# EAGLE design arm_femur_wLED_smd (EAGLE 7.3.0)
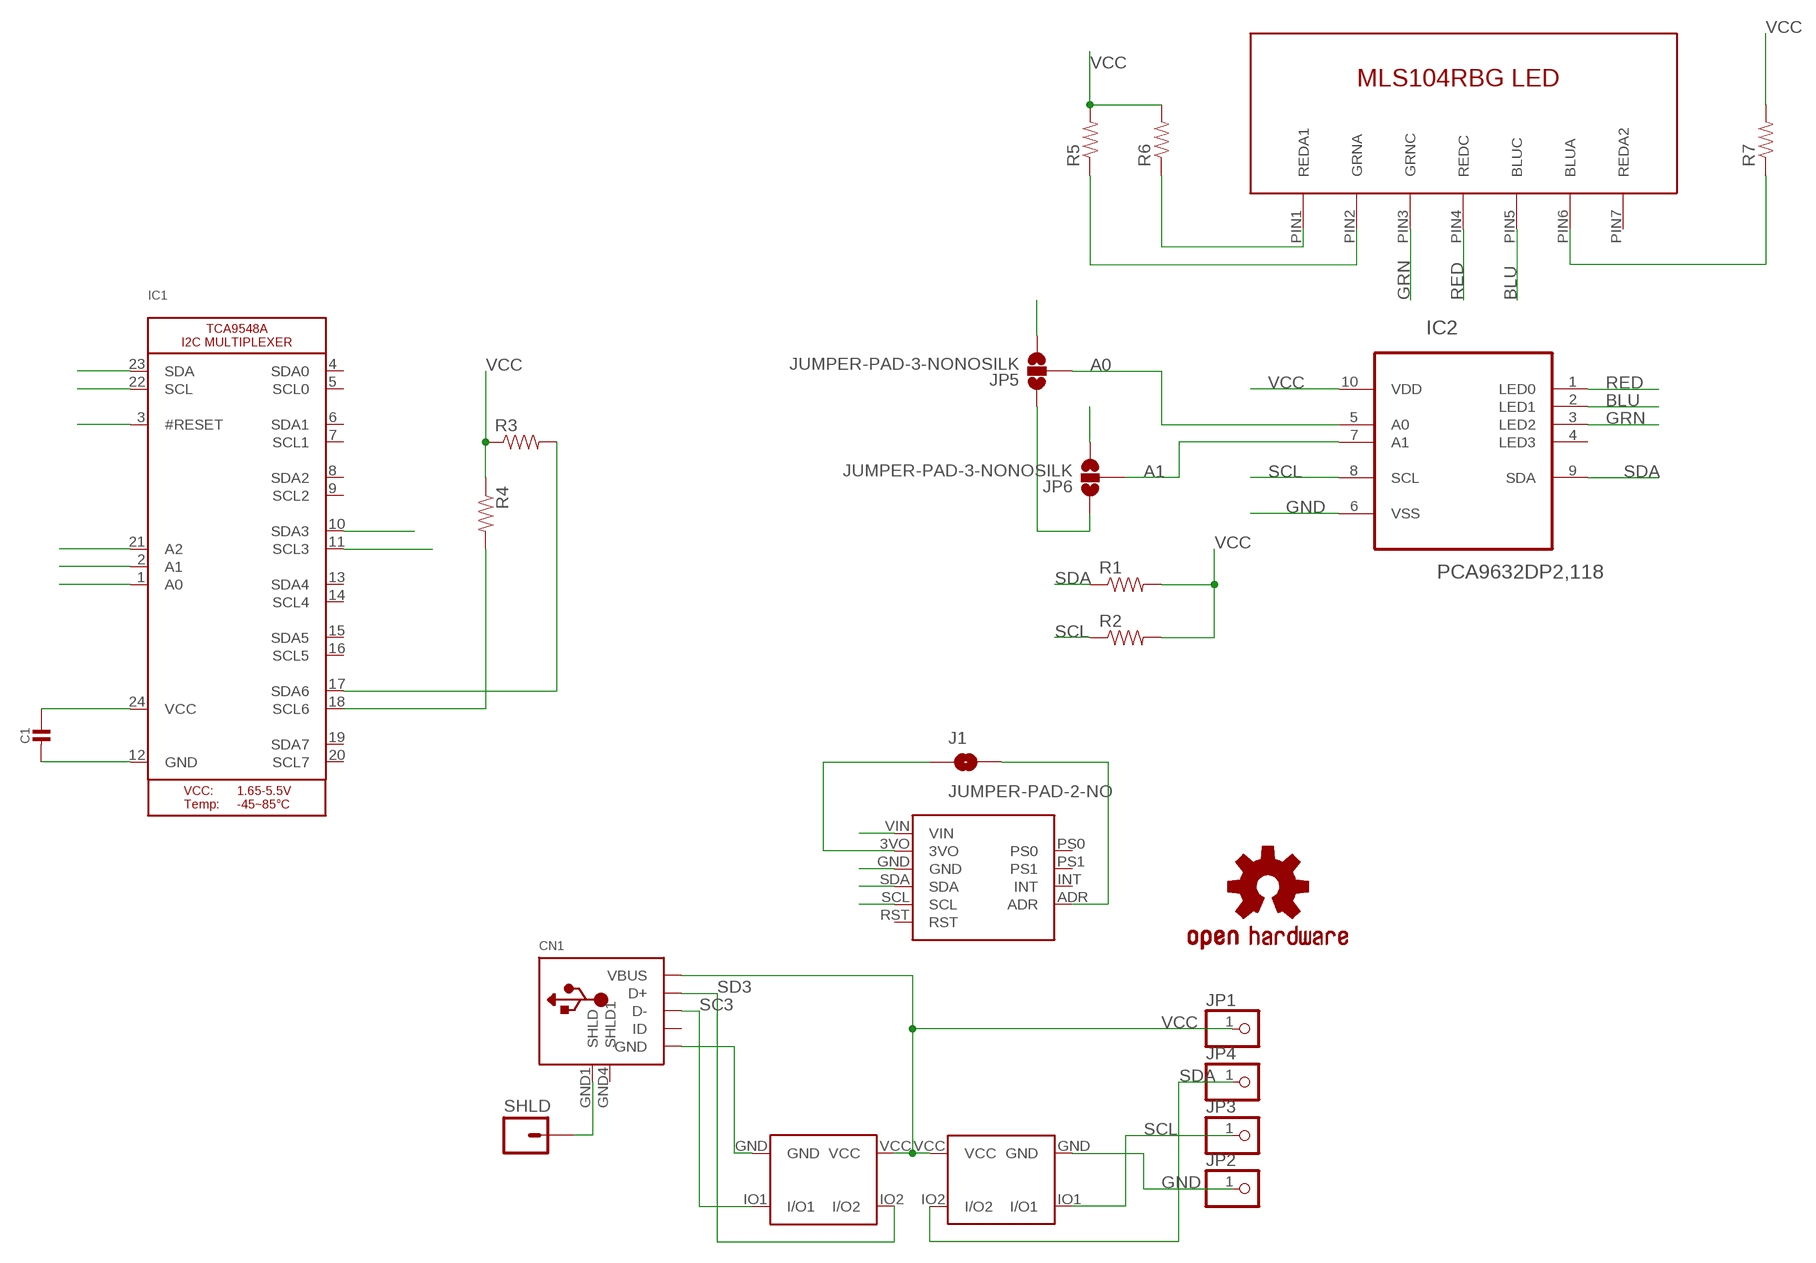
[diagram p0: schematic, sheet 1]

## Parts
C1  CAP_CERAMIC0805-NOTHERMALS  [0805_NOTHERMALS]
CN1  USB  [USB-MINIB-THM-MOLEX_NOSLK]
IC1  TCA9548A  [TSSOP24]
IC2  PCA9632DP2,118  [SOP50P490X110-10N]
J1  JUMPER-PAD-2-NO  [PAD-JUMPER-2-NO_NO_SILK]
JP1  PINHD-1X1CB  [1X01-CLEANBIG]
JP2  PINHD-1X1CB  [1X01-CLEANBIG]
JP3  PINHD-1X1CB  [1X01-CLEANBIG]
JP4  PINHD-1X1CB  [1X01-CLEANBIG]
JP5  JUMPER-PAD-3-NONOSILK  [PAD-JUMPER-3-NO_NO_SILK]
JP6  JUMPER-PAD-3-NONOSILK  [PAD-JUMPER-3-NO_NO_SILK]
LOGO1  OSHW-LOGOS  [OSHW-LOGO-S]
R1  RESISTOR0603-RES  [0603-RES]
R2  RESISTOR0603-RES  [0603-RES]
R3  RESISTOR0603-RES  [0603-RES]
R4  RESISTOR0603-RES  [0603-RES]
R5  RESISTOR0603-RES  [0603-RES]
R6  RESISTOR0603-RES  [0603-RES]
R7  RESISTOR0603-RES  [0603-RES]
SHLD  M01PTH  [1X01]
U$1  BNO_055_BKOUT  [BNO_BKOUT]
U$2  MSL0104RGB  [7-SMD]
U$3  TVS_ARRAY_CD143A  [SOT-143]
U$4  TVS_ARRAY_CD143A  [SOT-143]

## Nets
A0: IC2.5(A0) JP5.2
A1: IC2.7(A1) JP6.2
BLU: IC2.2(LED1) U$2.PIN5(BLUC)
GND: C1.2 CN1.GND IC1.2(A1) IC1.12(GND) IC1.21(A2) IC2.6(VSS) JP2.1 JP5.1 JP6.1 U$1.GND U$3.GND U$4.GND
GRN: IC2.3(LED2) U$2.PIN3(GRNC)
N$1: R6.1 U$2.PIN1(REDA1)
N$4: CN1.GND1(SHLD) SHLD.1
N$5: R5.1 U$2.PIN2(GRNA)
N$6: R7.1 U$2.PIN6(BLUA)
N$9: J1.1 U$1.3VO
N$10: J1.2 U$1.ADR
RED: IC2.1(LED0) U$2.PIN4(REDC)
SC3: CN1.D- IC1.11(SCL3) U$4.IO1(I/O1)
SC6: IC1.18(SCL6) R4.2 U$1.SCL
SCL: IC1.22(SCL) IC2.8(SCL) JP3.1 R2.1 U$3.IO1(I/O1)
SD3: CN1.D+ IC1.10(SDA3) U$4.IO2(I/O2)
SD6: IC1.17(SDA6) R3.2 U$1.SDA
SDA: IC1.23(SDA) IC2.9(SDA) JP4.1 R1.1 U$3.IO2(I/O2)
VCC: C1.1 CN1.VBUS IC1.1(A0) IC1.3(#RESET) IC1.24(VCC) IC2.10(VDD) JP1.1 JP5.3 JP6.3 R1.2 R2.2 R3.1 R4.1 R5.2 R6.2 R7.2 U$1.VIN U$3.VCC U$4.VCC
Unconnected: CN1.GND4(SHLD1) CN1.ID IC1.4(SDA0) IC1.5(SCL0) IC1.6(SDA1) IC1.7(SCL1) IC1.8(SDA2) IC1.9(SCL2) IC1.13(SDA4) IC1.14(SCL4) IC1.15(SDA5) IC1.16(SCL5) IC1.19(SDA7) IC1.20(SCL7) IC2.4(LED3) U$1.INT U$1.PS0 U$1.PS1 U$1.RST U$2.PIN7(REDA2)

## Library data of the parts
C1 = Adafruit TCA9548A:CAP_CERAMIC: Ceramic Capacitors For new designs, use the packages preceded by an '_' character since they are more reliable: The following footprints should be used on most boards: _0402 - Standard footprint for regular board layouts _0603 - Standard footprint for regular board layouts _0805 - Standard footprint for regular board layouts _1206 - Standard footprint for regular board layouts For extremely tight-pitch boards where space is at a premium, the following 'micro-pitch' footprints can be used (smaller pads, no silkscreen outline, etc.): _0402MP - Micro-pitch footprint for very dense/compact boards _0603MP - Micro-pitch footprint for very dense/compact boards _0805MP - Micro-pitch footprint for very dense/compact boards _1206MP - Micro-pitch footprint for very dense/compact boards
CN1 = adafruit:USB: USB Connectors USBMINIB - Surface Mount Female Mini-B USB Connector 4UConnector: 06564 By microbuilder.eu Thru-hole RA Female Mini-B USB Connector 4UConnector: 18732 By ladyada.net
IC1 = Adafruit TCA9548A:TCA9548A: TCA9548A I2C Multiplexer
IC2 = NXP_By_element14_Batch_1:PCA9632DP2,118: 4-bit Fm+ I2C-bus low power LED driver; MPN: PCA9632DP2,118; OC_FARNELL: 1867849; OC_NEWARK: 70R6723; PACKAGE: TSSOP-10; SUPPLIER: NXP
J1 = SparkFun-Passives:JUMPER-PAD-2-NO
JP1-JP4 = adafruit:PINHD-1X1: Pin header 1x1 for 0.1" spacing With round pins
JP5 JP6 = SparkFun-Passives:JUMPER-PAD-3-NO
LOGO1 = SparkFun-Aesthetics:OSHW-LOGO: Open Source Hardware Logo This logo indicates the piece of hardware it is found on incorporates a OSHW license and/or adheres to the definition of open source hardware found here: http://freedomdefined.org/OSHW
R1-R7 = SparkFun-Passives:RESISTOR: Resistor Basic schematic elements and footprints for 0603, 1206, and PTH resistors.
SHLD = SparkFun-Connectors:M01: Header 1 Standard 1-pin 0.1" header. Use with straight break away headers (SKU : PRT-00116), right angle break away headers (PRT-00553), swiss pins (PRT-00743), machine pins (PRT-00117), and female headers (PRT-00115). SMTSO-256-ET is a "flush mount" nut for a 4-40 screw. The older package used to be too tight, and did not allow it to sit properly thru the drill hit. The latest (0.165DIA) fits nice and snug.
U$1 = skeleton:BNO_055_BKOUT
U$2 = ROHM_led:MSL0104RGB
U$3 U$4 = skeleton:TVS_ARRAY_CD143A

## Board
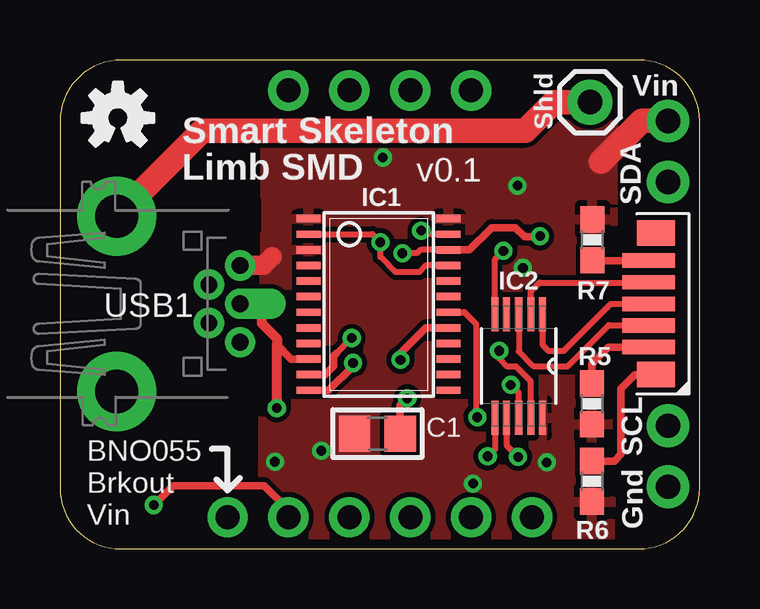
[diagram p1: board, top side]
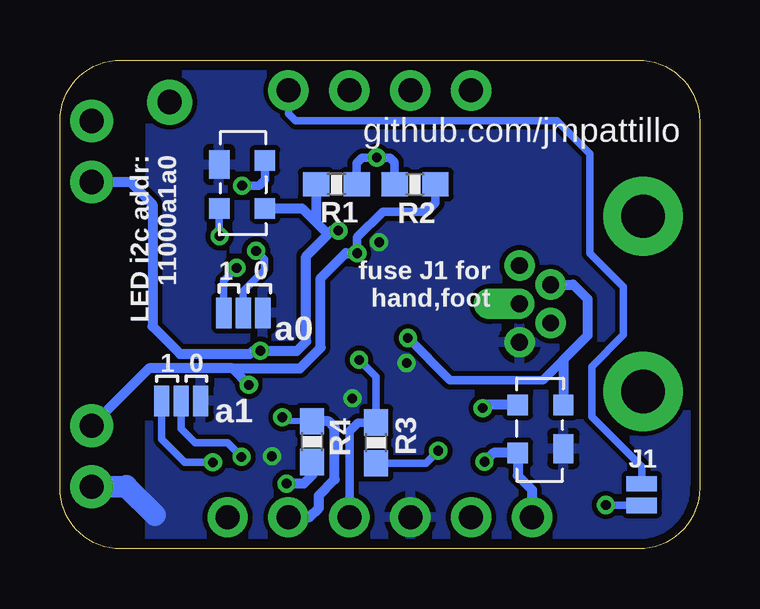
[diagram p2: board, bottom side, seen from below]

Size 26.67 x 20.37 mm. Coordinates in mm from the lower left corner, seen from the top.
Outline: 24.13,0 arc90 26.67,2.54 26.67,17.83 arc90 24.13,20.37 2.57,20.37 arc90 0,17.81 0,2.54 arc90 2.54,0 24.13,0
Copper layers (1*16): Top 0.0356mm / dielectric 1.5011mm / Bottom 0.0356mm
Design rules "LaenPCBOrder *": minimum track width 6mil, minimum drill 13mil, track to track 8mil, track to pad 8mil, pad to pad 8mil, via to via 6mil, smd to smd 6mil, copper to edge 15mil, drill to drill 6mil, minimum pad ring 7mil, minimum via ring 7mil, stop-mask expansion 0mil, vias tented up to drill 25mil, thermal gap 10mil

### Footprints (pad centres in the part's own frame; a part is rotated, then mirrored left to right if it is on the bottom)
0805_NOTHERMALS = smd 1.3 x 1.5: 1 -0.95,0; 2 0.95,0
USB-MINIB-THM-MOLEX_NOSLK = drill 0.7 pad 1.27 offset: D+ 0,9.72 | drill 0.7 pad 1.27: D- -0.8,8.42; GND 1.6,9.72; ID 0.8,8.42; VBUS -1.6,9.72 | drill 1.8 pad 3.302: GND1 -3.65,4.57; GND4 3.65,4.57
TSSOP24 = smd 0.305 x 0.991: 1 -3.575,-2.918; 2 -2.925,-2.918; 3 -2.275,-2.918; 4 -1.625,-2.918; 5 -0.975,-2.918; 6 -0.325,-2.918; 7 0.325,-2.918; 8 0.975,-2.918; 9 1.625,-2.918; 10 2.275,-2.918; 11 2.925,-2.918; 12 3.575,-2.918; 13 3.575,2.918; 14 2.925,2.918; 15 2.275,2.918; 16 1.625,2.918; 17 0.975,2.918; 18 0.325,2.918; 19 -0.325,2.918; 20 -0.975,2.918; 21 -1.625,2.918; 22 -2.275,2.918; 23 -2.925,2.918; 24 -3.575,2.918
SOP50P490X110-10N = smd 1.422 x 0.305: 1 -2.159,0.991; 2 -2.159,0.508; 3 -2.159,0; 4 -2.159,-0.508; 5 -2.159,-0.991; 6 2.159,-0.991; 7 2.159,-0.508; 8 2.159,0; 9 2.159,0.508; 10 2.159,0.991
PAD-JUMPER-2-NO_NO_SILK = smd 0.635 x 1.27: 1 -0.45,0; 2 0.45,0
1X01-CLEANBIG = drill 1.016 pad 1.778: 1 0,0
PAD-JUMPER-3-NO_NO_SILK = smd 0.635 x 1.27: 1 -0.813,0; 2 0,0; 3 0.813,0
0603-RES = smd 1.1 x 1: 1 -0.85,0; 2 0.85,0
1X01 = drill 1.016 pad 1.88: 1 0,0
BNO_BKOUT = drill 1 pad 1.676: 3VO -3.81,-8.89; ADR 3.81,8.89; GND -1.27,-8.89; INT 1.27,8.89; PS0 -3.81,8.89; PS1 -1.27,8.89; RST 6.35,-8.89; SCL 3.81,-8.89; SDA 1.27,-8.89; VIN -6.35,-8.89
7-SMD = smd 1.58 x 1.06: PIN1 0.3,-2.95; PIN7 0.3,2.95 | smd 2.18 x 0.6: PIN2 0,-1.8; PIN3 0,-0.9; PIN4 0,0; PIN5 0,0.9; PIN6 0,1.8
SOT-143 = smd 1.2 x 0.85: GND -0.75,-0.95 | smd 0.85 x 0.85: IO1 1.075,-0.95; IO2 1.075,0.95; VCC -0.925,0.95

### Placement (x,y rotation side)
C1  13.23,4.8 0 top
CN1  -2.21,10.21 270 top
IC1  13.28,10.19 270 top
IC2  19.13,7.62 270 top
J1  2.41,2.26 90 bottom
JP1  25.35,17.83 0 top
JP2  25.35,2.59 0 top
JP3  25.35,5.13 0 top
JP4  25.35,15.29 0 top
JP5  19.02,9.83 180 bottom
JP6  21.62,6.17 180 bottom
LOGO1  2.41,17.96 0 top
R1  15.14,15.19 0 bottom
R2  11.86,15.19 180 bottom
R3  13.49,4.42 90 bottom
R4  16.15,4.47 90 bottom
R5  22.17,6.05 270 top
R6  22.17,2.82 270 top
R7  22.2,12.88 90 top
SHLD  22.1,18.62 270 top
U$1  13.34,10.21 0 top
U$2  24.54,10.21 0 top
U$3  19.08,15.27 270 bottom
U$4  6.63,4.93 90 bottom

### Tracks (layer width: path | path; a pad name or v marks a point on that pad's centre or on a via)
A0  (via drill 0.4)
  Top 0.254: IC2.5 18.14,12.06 v18.49,12.42
  Bottom 0.305: JP5.2 19.02,10.74 18.14,11.63 18.14,12.06 v18.49,12.42
A1  (via drill 0.4)
  Top 0.254: IC2.7 18.62,4.32 v19.1,3.84
  Bottom 0.305: JP6.2 21.62,5 21.03,4.42 19.68,4.42 v19.1,3.84
BLU
  Top 0.254: IC2.2 19.63,10.74 19.99,11.1 24.53,11.1
  Top 0.305: 24.53,11.1 U$2.PIN5
GND  (via drill 0.4)
  Top 0.254: IC1.21 15.26,11.81 14.99,11.53 14,11.53 13.36,12.17 v13.36,12.78 13.03,13.11 IC1.2 | IC2.6 18.14,4.17 v17.83,3.86
  Top 0.305: IC1.12 11.21,6.61 12.22,7.62 v12.22,7.75 | C1.2 14.18,5.98 v14.48,6.27
  Bottom 0.914: JP2.1 23.9,2.62 22.71,1.42
  pour Bottom: 0.08,20.93 22.91,20.85 22.94,0.08 -0.03,0.1
GRN
  Top 0.254: IC2.3 19.13,8.23 19.74,7.62 21.18,7.62 22.89,9.32 24.53,9.32
  Top 0.305: 24.53,9.32 U$2.PIN3
N$1
  Top 0.305: U$2.PIN1 23.97,7.26 23.39,6.68 23.39,3.94 23.11,3.66 22.19,3.66
  Top 0.406: 22.19,3.66 R6.1
N$4
  Top 1.016: CN1.GND1 5.92,17.42 19.41,17.42 20.6,18.62 SHLD.1
N$5
  Top 0.305: U$2.PIN2 22.86,8.41 22.17,7.72 R5.1
N$6
  Top 0.305: U$2.PIN6 22.22,12.01
  Top 0.508: 22.22,12.01 R7.1
N$9  (via drill 0.4)
  Top 0.305: U$1.3VO 9.52,1.63 8.51,2.64 4.72,2.64 v3.91,1.83
  Bottom 0.305: v3.91,1.83 2.43,1.83 J1.1
N$10
  Bottom 0.305: U$1.ADR 17.14,18.14 16.84,17.83 5.94,17.83 4.57,16.46 4.57,12.32 3.17,10.92 3.17,8.92 4.5,7.59 4.5,5.51 2.41,3.43 J1.2
RED
  Top 0.254: IC2.1 20.12,8.51 20.37,8.25 21.01,8.25 22.96,10.21 U$2.PIN4
SC3  (via drill 0.4)
  Top 0.279: 11.53,8.15 v12.17,8.79
  Top 0.305: 11.53,8.15 11.4,8.03 11.4,7.62 11.04,7.26 IC1.11
  Bottom 0.356: 5.68,7.86 5.69,7.87 | 5.69,7.87 5.69,7.44 | v12.17,8.79 10.41,7.04 6.53,7.04 5.69,7.87
  Bottom 0.406: CN1.D- 5.27,11.01 4.67,10.41 4.67,8.89 5.69,7.87 | 5.68,7.86 U$4.IO1
SC6  (via drill 0.4)
  Top 0.254: IC1.18 16.86,9.86 17.35,9.37 17.35,5.54 v17.4,5.49
  Bottom 0.254: R4.2 17.23,5.32 v17.4,5.49
  Bottom 0.406: R4.2 16.14,5.31 15.47,5.31 15.21,5.05 15.21,2.9 15.87,2.23 15.87,1.7 16.26,1.32 U$1.SCL
SCL  (via drill 0.4)
  Top 0.254: IC2.8 19.13,6.5 v18.8,6.83 | IC1.22 15.03,12.46 14.88,12.32 v14.27,12.32
  Top 0.305: IC1.22 17.08,12.46 18.01,13.39 19,13.39 19.38,13 19.99,13 v20.02,13.03
  Bottom 0.305: U$3.IO1 v20.03,13.04 v20.02,13.03
  Bottom 0.356: R2.1 11.01,14.41 11.38,14.05 13.21,14.05 14.27,12.98 v14.27,12.32
  Bottom 0.406: 19.48,7.52 v18.8,6.83 | 19.48,7.52 16.66,7.52 15.8,8.38 15.8,11.28 14.76,12.32 v14.27,12.32 | 19.48,7.52 22.96,7.52 JP3.1
SD3  (via drill 0.4)
  Top 0.305: IC1.10 9.64,7.91 9.04,8.51
  Top 0.406: CN1.D+ 8.25,10.21 8.41,10.06 8.41,9.4 9.04,8.76 9.04,8.51 v9.04,5.87
  Bottom 0.406: U$4.IO2 8.91,6 v9.04,5.87
SD6  (via drill 0.4)
  Top 0.305: IC1.17 15.26,9.21 14.2,8.15 v14.2,7.87
  Bottom 0.305: R3.2 13.49,7.16 v14.2,7.87
  Bottom 0.356: U$1.SDA 14.6,4.9 14.25,5.26 13.5,5.26 R3.2
SDA  (via drill 0.4)
  Top 0.254: IC1.23 15.21,13.11 v15.06,13.26 | IC2.9 19.63,6.98 19.02,7.59 18.64,7.59 18.31,7.92 v18.31,8.25
  Bottom 0.406: JP4.1 23.75,15.29 22.81,14.35 22.81,9.27 21.67,8.13 18.75,8.13 18.62,8.25 v18.31,8.25 16.79,8.25 16.41,8.64 16.41,12.19 15.49,13.11 | 15.49,13.11 15.34,13.26 v15.06,13.26 | R1.1 15.99,13.6 | 15.99,13.6 15.49,13.11 | U$3.IO2 16.58,14.19 15.99,13.6
VCC  (via drill 0.4)
  Top 0.813: CN1.VBUS 8.48,11.81 8.84,12.17
  Top 1.016: JP1.1 24.26,17.83 22.56,16.13
  Bottom 0.305: JP5.3 19.84,11.18 v19.3,11.71 | U$3.VCC 18.13,16.09 | JP6.3 22.43,4.57 21.46,3.61 v20.29,3.61 | R3.1 11.42,3.57 v10.9,4.09
  Bottom 0.356: 18.13,16.09 18.13,15.38 18.36,15.14 v19.08,15.14 | R2.2 12.71,16.12 12.9,16.31 v13.46,16.31 14.07,16.31 14.3,16.08 14.3,15.2 R1.2
  Bottom 0.406: U$1.VIN 6.98,2.46 7.58,3.06 U$4.VCC 8.6,4 v8.97,3.63 | R4.1 16.15,3.07 16.51,2.72 v17.22,2.72
  pour Top: 8.61,20.62 23.06,21.11 22.94,-0.33 8.46,-0.2

### Text on the board
tPlace: Smart Skeleton / Limb SMD | v0.1
bPlace: 0 | 1 | a0 | 0 | 1 | a1 | J1
tNames: Vin | Shld | SDA | USB1 | SCL | BNO055 / Brkout / Vin | Gnd
bNames: github.com/jmpattillo | LED i2c addr: / 11000a1a0 | fuse J1 for / hand,foot